# Altium schematic sheet JTAG_XC7Z010.SchDoc
size A4; SheetNumber: 4; SheetTotal: 5
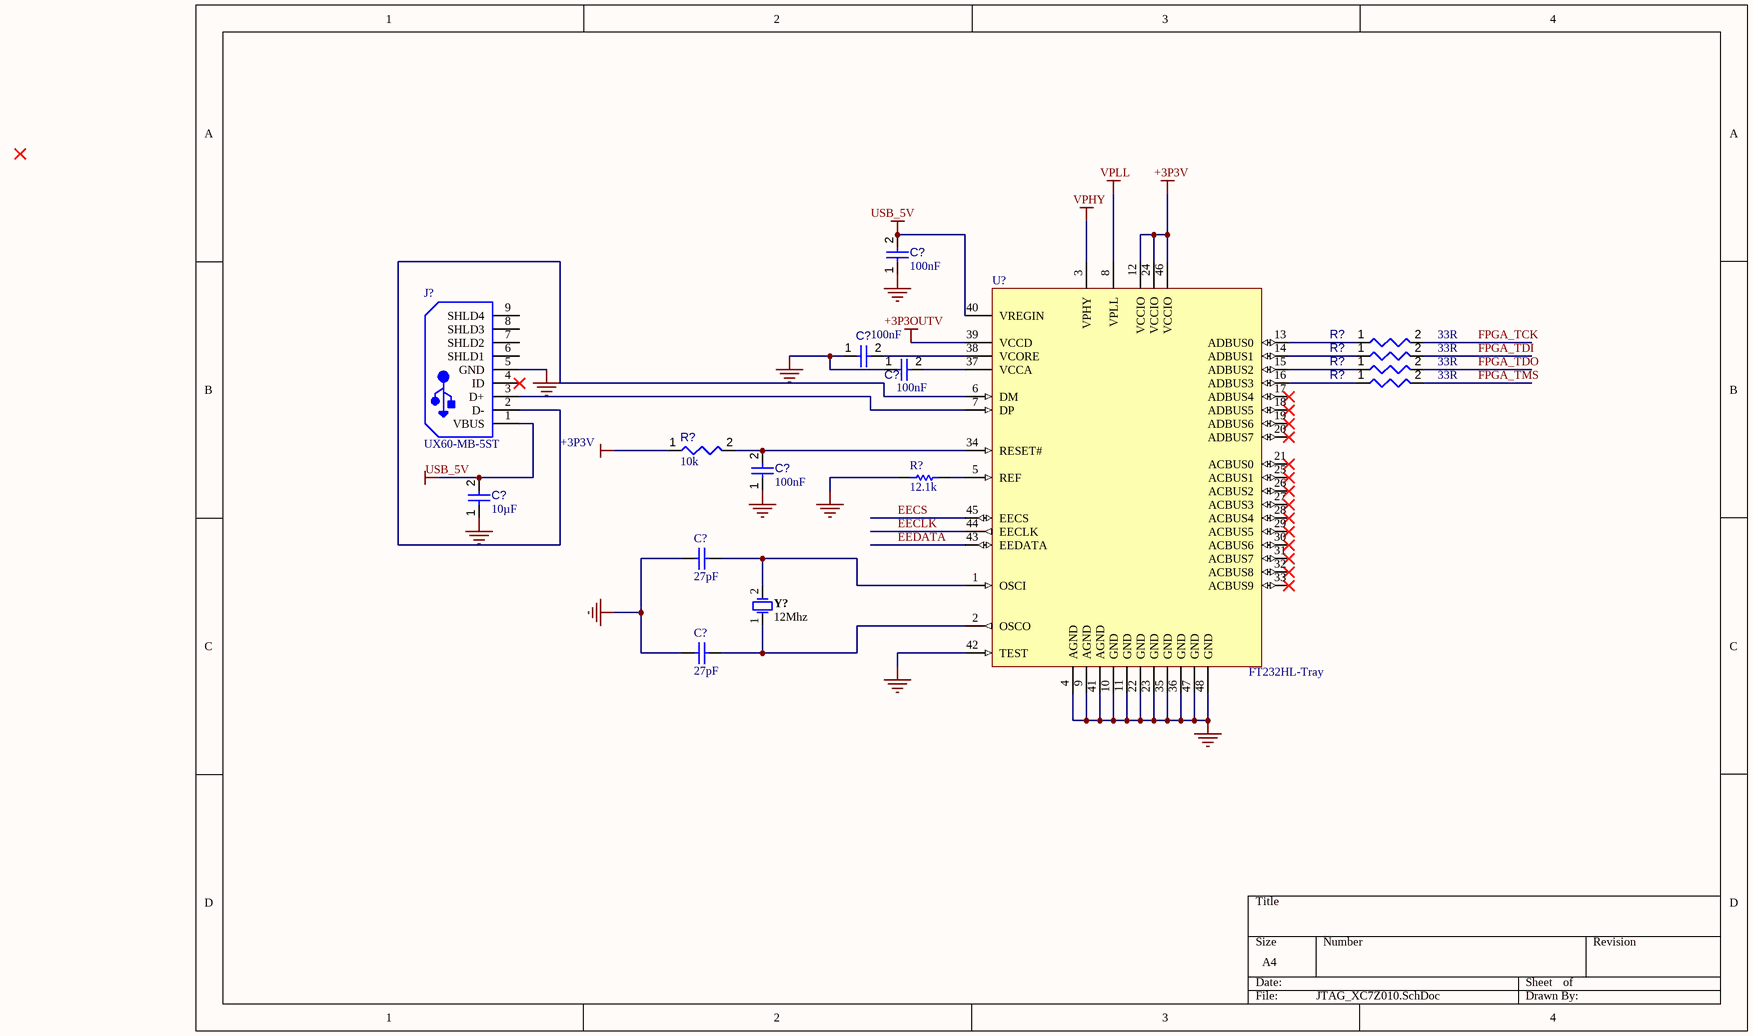
[diagram p0: JTAG_XC7Z010.SchDoc]

## Parts
(Parts that share a designator on the sheet are numbered #1, #2 ... from top to bottom, then left to right.)
C?#1  value 100nF  [CAPC1608X90X40NL10T20]  (hidden comment: Capacitor 100 nF +/-10% 50 V 0603)
C?#2  value 100nF  [CAPC1608X90X40NL10T20]  (hidden comment: Capacitor 100 nF +/-10% 50 V 0603)
C?#3  value 100nF  [CAPC1608X90X40NL10T20]  (hidden comment: Capacitor 100 nF +/-10% 50 V 0603)
C?#4  value 100nF  [CAPC1608X90X40NL10T20]  (hidden comment: Capacitor 100 nF +/-10% 50 V 0603)
C?#5  value 10µF  [CAPC2013X135X45NL10T25]  (hidden comment: Capacitor 10 uF +/- 10% 16 V 0805)
C?#6  27pF  [CAPC1608X90X40LL10T20]
C?#7  27pF  [CAPC1608X90X40LL10T20]
J?  UX60-MB-5ST  [HIRO-UX60-MB-5ST_V]
R?#1  value 33R  [RESC1005X40X25ML10T10]  (hidden comment: Resistor 33R +/-1% 0402 63 mW)
R?#2  value 33R  [RESC1005X40X25ML10T10]  (hidden comment: Resistor 33R +/-1% 0402 63 mW)
R?#3  value 33R  [RESC1005X40X25ML10T10]  (hidden comment: Resistor 33R +/-1% 0402 63 mW)
R?#4  value 33R  [RESC1005X40X25ML10T10]  (hidden comment: Resistor 33R +/-1% 0402 63 mW)
R?#5  value 10k  [RESC1608X55X25ML10T15]  (hidden comment: Resistor 10k +/-1% 0603 100 mW)
R?#6  12.1k  [RESC1608X55X30ML15T15]
U?  FT232HL-Tray  [LQFP-48_M]
Y?  12Mhz  [FOX-FOXSLF-2_V]

## Nets
GND: C?#1.1 C?#2.1 C?#3.1 C?#4.1 C?#5.1 C?#6.1 C?#7.1 J?.5(GND) R?#6.1 U?.4(AGND) U?.9(AGND) U?.10(GND) U?.11(GND) U?.22(GND) U?.23(GND) U?.35(GND) U?.36(GND) U?.41(AGND) U?.42(TEST) U?.47(GND) U?.48(GND)
VCC: C?#1.2 C?#5.2 J?.1(VBUS) R?#5.1 U?.3(VPHY) U?.8(VPLL) U?.12(VCCIO) U?.24(VCCIO) U?.39(VCCD) U?.40(VREGIN) U?.46(VCCIO)
EECLK: U?.44(EECLK)
EECS: U?.45(EECS)
EEDATA: U?.43(EEDATA)
FPGA_TCK: R?#1.2
FPGA_TDI: R?#2.2
FPGA_TDO: R?#3.2
FPGA_TMS: R?#4.2
NetC?#2_2: C?#2.2 U?.38(VCORE)
NetC?#3_2: C?#3.2 U?.37(VCCA)
NetC?#4_2: C?#4.2 R?#5.2 U?.34(RESET#)
NetC?#6_2: C?#6.2 U?.1(OSCI) Y?.2
NetC?#7_2: C?#7.2 U?.2(OSCO) Y?.1
NetJ?_2: J?.2(D-) U?.6(DM)
NetJ?_3: J?.3(D+) U?.7(DP)
NetR?#1_1: R?#1.1 U?.13(ADBUS0)
NetR?#2_1: R?#2.1 U?.14(ADBUS1)
NetR?#3_1: R?#3.1 U?.15(ADBUS2)
NetR?#4_1: R?#4.1 U?.16(ADBUS3)
NetR?#6_2: R?#6.2 U?.5(REF)

Not connected (* = marked no-connect by the designer): J? 4(ID)* 6(SHLD1) 7(SHLD2) 8(SHLD3) 9(SHLD4); U? 17(ADBUS4)* 18(ADBUS5)* 19(ADBUS6)* 20(ADBUS7)* 21(ACBUS0)* 25(ACBUS1)* 26(ACBUS2)* 27(ACBUS3)* 28(ACBUS4)* 29(ACBUS5)* 30(ACBUS6)* 31(ACBUS7)* 32(ACBUS8)* 33(ACBUS9)*

## Notes on the sheet
- +3P3V
- Labels drawn without touching a wire or pin: +3P3OUTV, +3P3V, USB_5V, VPHY, VPLL

## Library data of the parts
C?#1-C?#4 = CMP-001-00017-6: Chip Capacitor, 100 nF, +/- 10%, 50 V, 0603 (1608 Metric); Voltage Rating: 50V; Capacitor Type: Ceramic; Tolerance: 10%; Mounting Technology: SM; Max Operating Temperature: 125°C; RoHS Compliant: True; Pins: 2; Case/Package: 0603; Min Operating Temperature: -55°C
C?#5 = CMP-001-00015-6: Chip Capacitor, 10 uF, +/- 10%, 16 V, 0805 (2012 Metric); Voltage Rating: 16V; Capacitor Type: Ceramic; RoHS Compliant: True; Max Operating Temperature: 85°C; Min Operating Temperature: -55°C; Mounting Technology: SM; Tolerance: 10%; Case/Package: 0805; Pins: 2
C?#6 C?#7 = CMP-1659-00027-1: Chip Capacitor, 27 pF, +/- 5%, 50 V, -55 to 125 degC, 0603 (1608 Metric), RoHS, Tape and Reel; Capacitance: 10 uF; Tolerance: 10%; Voltage Rating (DC): 16 V; Case\Package: 1206; Type (Capacitors): X7R; Width: 1.6 mm; Pins: 2; Height: 1.6 mm; RoHSCompliant: true; PackageDescription: 2-Pin Surface Mount Device, Body 1.6 x 0.8 mm; Package Quantity: 2000; ComponentLink1Description: Manufacturer URL; Voltage Rating: 16 V; REACH SVHC: No SVHC; ComponentLink2Description: Datasheet; ComponentLink2URL: http://www.yageo.com/NewPortal/yageodocoutput?fileName=/pdf/MLCC/UPY-GP_NP0_16V-to-50V_14.pdf; Min Operating Temperature: -55 degC; PackageReference: 0603; Mount: Surface Mount; Case Code (Metric): 3216; Packaging: Tape and Reel; Radiation Hardening: No; DatasheetVersion: Rev. 14, 07/2016; Case Code (Imperial): 1206; ComponentLink1URL: http://www.yageo.com/; Max Operating Temperature: 125 degC; Length: 3.2 mm
J? = CMP-2000-07375-1: USB Connector Mini B Type, 1 A, 5 V AC, -30 to 75 degC, 5-Pin SMD, RoHS, Tape and Reel; Manufacturer: Hirose Electric; No of Positions: 5; Style/Orientation: RightAngleSocket/Receptacle; Pitch: 0.8mm; Datasheet Version: 04/2008; Datasheet URL: http://datasheet.octopart.com/UX60-MB-5ST-Hirose-datasheet-8329595.pdf; Type: WiretoBoard; Package Reference: UX60-MB-5ST; Termination: SurfaceMount; Manufacturer URL: https://www.hirose.com; Mounting Technology: SurfaceMount; Package Description: 5-Pin Surface Mount Device, Body 7.7 x 9 mm, Pitch 0.8 mm
R?#1-R?#4 = CMP-009-00029-5: Chip Resistor, 33 Ohm, +/- 1%, 0.063 W, -55 to 155 degC, 0402 (1005 Metric); Power: 63mW; Pins: 2; Mounting Technology: SM; Min Operating Temperature: -55°C; Tolerance: 1%; Max Operating Temperature: 155°C; RoHS Compliant: True; Case/Package: 0402
R?#5 = CMP-009-00017-5: Chip Resistor, 10 KOhm, +/- 1%, 01 W, -55 to 155 degC, 0603 (1608 Metric); Voltage Rating: 50V; Power: 100mW; RoHS Compliant: True; Min Operating Temperature: -55°C; Pins: 2; Case/Package: 0603; Mounting Technology: SM; Max Operating Temperature: 155°C; Tolerance: 1%
R?#6 = CMP-2000-00220-1: Manufacturer: Panasonic; Part Number: ERJ-3EKF1212V
U? = CMP-0078-00036-3: Single Channel Hi-Speed USB to Multipurpose UART/FIFO IC, 48-pin LQFP, Tray; Manufacturer: FTDI; PackageVersion: Dec-12; DatasheetVersion: ver 1.8, Dec-2012; PartNumber: FT232HL-Tray; PackageDescription: 48-Pin Thin Quad Flat Pack, 7 x 7 mm Body, 0.5 mm Pitch; ComponentLink1URL: http://www.ftdichip.com/; PackageReference: LQFP-48; ComponentLink1Description: Manufacturer URL; ComponentLink2Description: Datasheet; ComponentLink2URL: http://www.ftdichip.com/Support/Documents/DataSheets/ICs/DS_FT232H.pdf; RevisionNote: DatasheetVersion updated to 1.8 Dec-2012
Y? = CMP-1749-00004-1: Resistance Weld Thru-Hole Crystal, 12 MHz, +/-30 ppm, -20 to 70 degC, 2-Pin THD, RoHS, Bulk; Elements: 1; Rds On Max: 115 mohm; Typical Rise Time: 90 ns; Max Power Dissipation: 2.5 W; Case\Package: TO-251-3; Input Capacitance: 350 pF; REACH SVHC: No SVHC; Length: 6.6 mm; ComponentLink1URL: http://www.foxonline.com/; PackageDescription: 2-Pin Through Hole Device, Body 11.35 x 4.65 mm, Pitch 4.88 mm; Radiation Hardening: No; Package Quantity: 70; Packaging: Rail/Tube; ComponentLink1Description: Manufacturer URL; Min Operating Temperature: -55 degC; Max Operating Temperature: 150 degC; RoHSCompliant: true; PackageReference: FOXSLF-2; DatasheetVersion: Mar-15; Pins: 3; Height: 6.1 mm; Mount: Through Hole; ComponentLink2URL: http://www.foxonline.com/pdfs/hc49slf.pdf; ComponentLink2Description: Datasheet; Width: 2.3 mm